# Altium schematic sheet Meow.SchDoc: Science Sensor: Meow
size Letter; Author: Emela M.; Organization: Husky Robotics; Address1: University of Washington; Address2: Mechanical Engineering; Address3: Seattle, WA; Revision: A; SheetNumber: 6; SheetTotal: 6
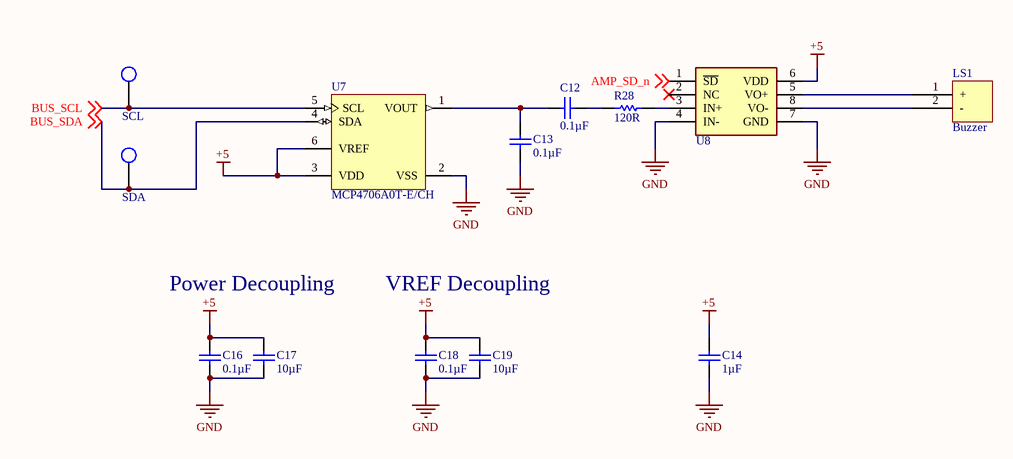
[diagram p0: Meow.SchDoc]

## Parts
C12  Capacitance: 0.1µF  [Cap 0805]  (hidden comment: Capacitor 0805)
C13  Capacitance: 0.1µF  [Cap 0805]  (hidden comment: Capacitor 0805)
C14  Capacitance: 1µF  [Cap 0805]  (hidden comment: Capacitor 0805)
C16  Capacitance: 0.1µF  [Cap 0805]  (hidden comment: Capacitor 0805)
C17  Capacitance: 10µF  [Cap 0805]  (hidden comment: Capacitor 0805)
C18  Capacitance: 0.1µF  [Cap 0805]  (hidden comment: Capacitor 0805)
C19  Capacitance: 10µF  [Cap 0805]  (hidden comment: Capacitor 0805)
LS1  Buzzer  [Buzzer]
R28  value 120R  [RESC0805(2012)_N]  (hidden comment: Resistor 0805)
SCL  Test Point  [Test Point Through-hole]  (value not drawn)
SDA  Test Point  [Test Point Through-hole]  (value not drawn)
U7  MCP4706A0T-E/CH  [SOT-23-CH6_M]
U8  Amplifier  [Amplifier]  (value not drawn)

## Nets
+5: C14.2 C16.2 C17.1 C18.2 C19.2 U7.3(VDD) U7.6(VREF) U8.6(VDD)
GND: C13.1 C14.1 C16.1 C17.2 C18.1 C19.1 U7.2(VSS) U8.4(IN-) U8.7(GND)
AMP_SD_n: U8.1(~{SD}) ; off-sheet AMP_SD_n
BUS_SCL: SCL.1 U7.5(SCL) ; off-sheet BUS_SCL
BUS_SDA: SDA.1 U7.4(SDA) ; off-sheet BUS_SDA
NetC12_1: C12.1 C13.2 U7.1(VOUT)
NetC12_2: C12.2 R28.2
NetLS1_1: LS1.1(+) U8.5(VO+)
NetLS1_2: LS1.2(-) U8.8(VO-)
NetR28_1: R28.1 U8.3(IN+)

Not connected (* = marked no-connect by the designer): U8 2(NC)*

## Notes on the sheet
- Power Decoupling
- VREF Decoupling
- Title
- Size:
- Date:
- A
- Author:
- Revision:
- Sheet
- of
- File:

## Library data of the parts
C12-C14 C16-C19 = Capacitor 0805: Standard Capacitor; Manufacturer: AVX; Tolerance (%): ±10%; Dielectric: X5R; Rated Voltage: 10V; Datasheet Version: 05/2016; Manufacturer URL: http://www.avx.com/; Package Description: 2-Pin Surface Mount Device, Body 2.01 x 1.25 mm; Mounting Technology: SurfaceMount; Case Size/Dimension: 0805; Package Reference: 0805; Datasheet URL: http://datasheets.avx.com/cx5r.pdf
LS1 = Buzzer: PK-21N30PQ
R28 = Resistor 0805: Generic 0805 Resistor; Tolerance: 5 %; Case-Metric: 2012; Case-EIA: 0805; Power: 0.125 W; Technology: SMT
U7 = CMP-0188-01198-1: 8-Bit Voltage Output Digital-to-Analog Converter with EEPROM and I2C Interface, 6-Pin SOT-23, Extended Temperature, Tape and Reel; PackageReference: SOT-23-CH6; Code_IPC: SOT26A-6; ComponentLink3URL: http://www.microchip.com/stellent/groups/techpub_sg/documents/packagingspec/en012702.pdf; ComponentLink1URL: http://www.microchip.com/; ComponentLink2URL: http://ww1.microchip.com/downloads/en/DeviceDoc/22272B.pdf; PackageDescription: 6-Lead Plastic Small Outline Transistor (CH) [SOT-23]; PackageVersion: revBB, Aug-2009; ComponentLink2Description: Datasheet; ComponentLink1Description: Manufacturer URL; DatasheetVersion: revB, Sep-2011; ComponentLink3Description: Package Specification
U8 = Amplifier: PAM8302AADCR MEOW